# EAGLE schematic KsbLightSensorSchematic (EAGLE 7.2.0)
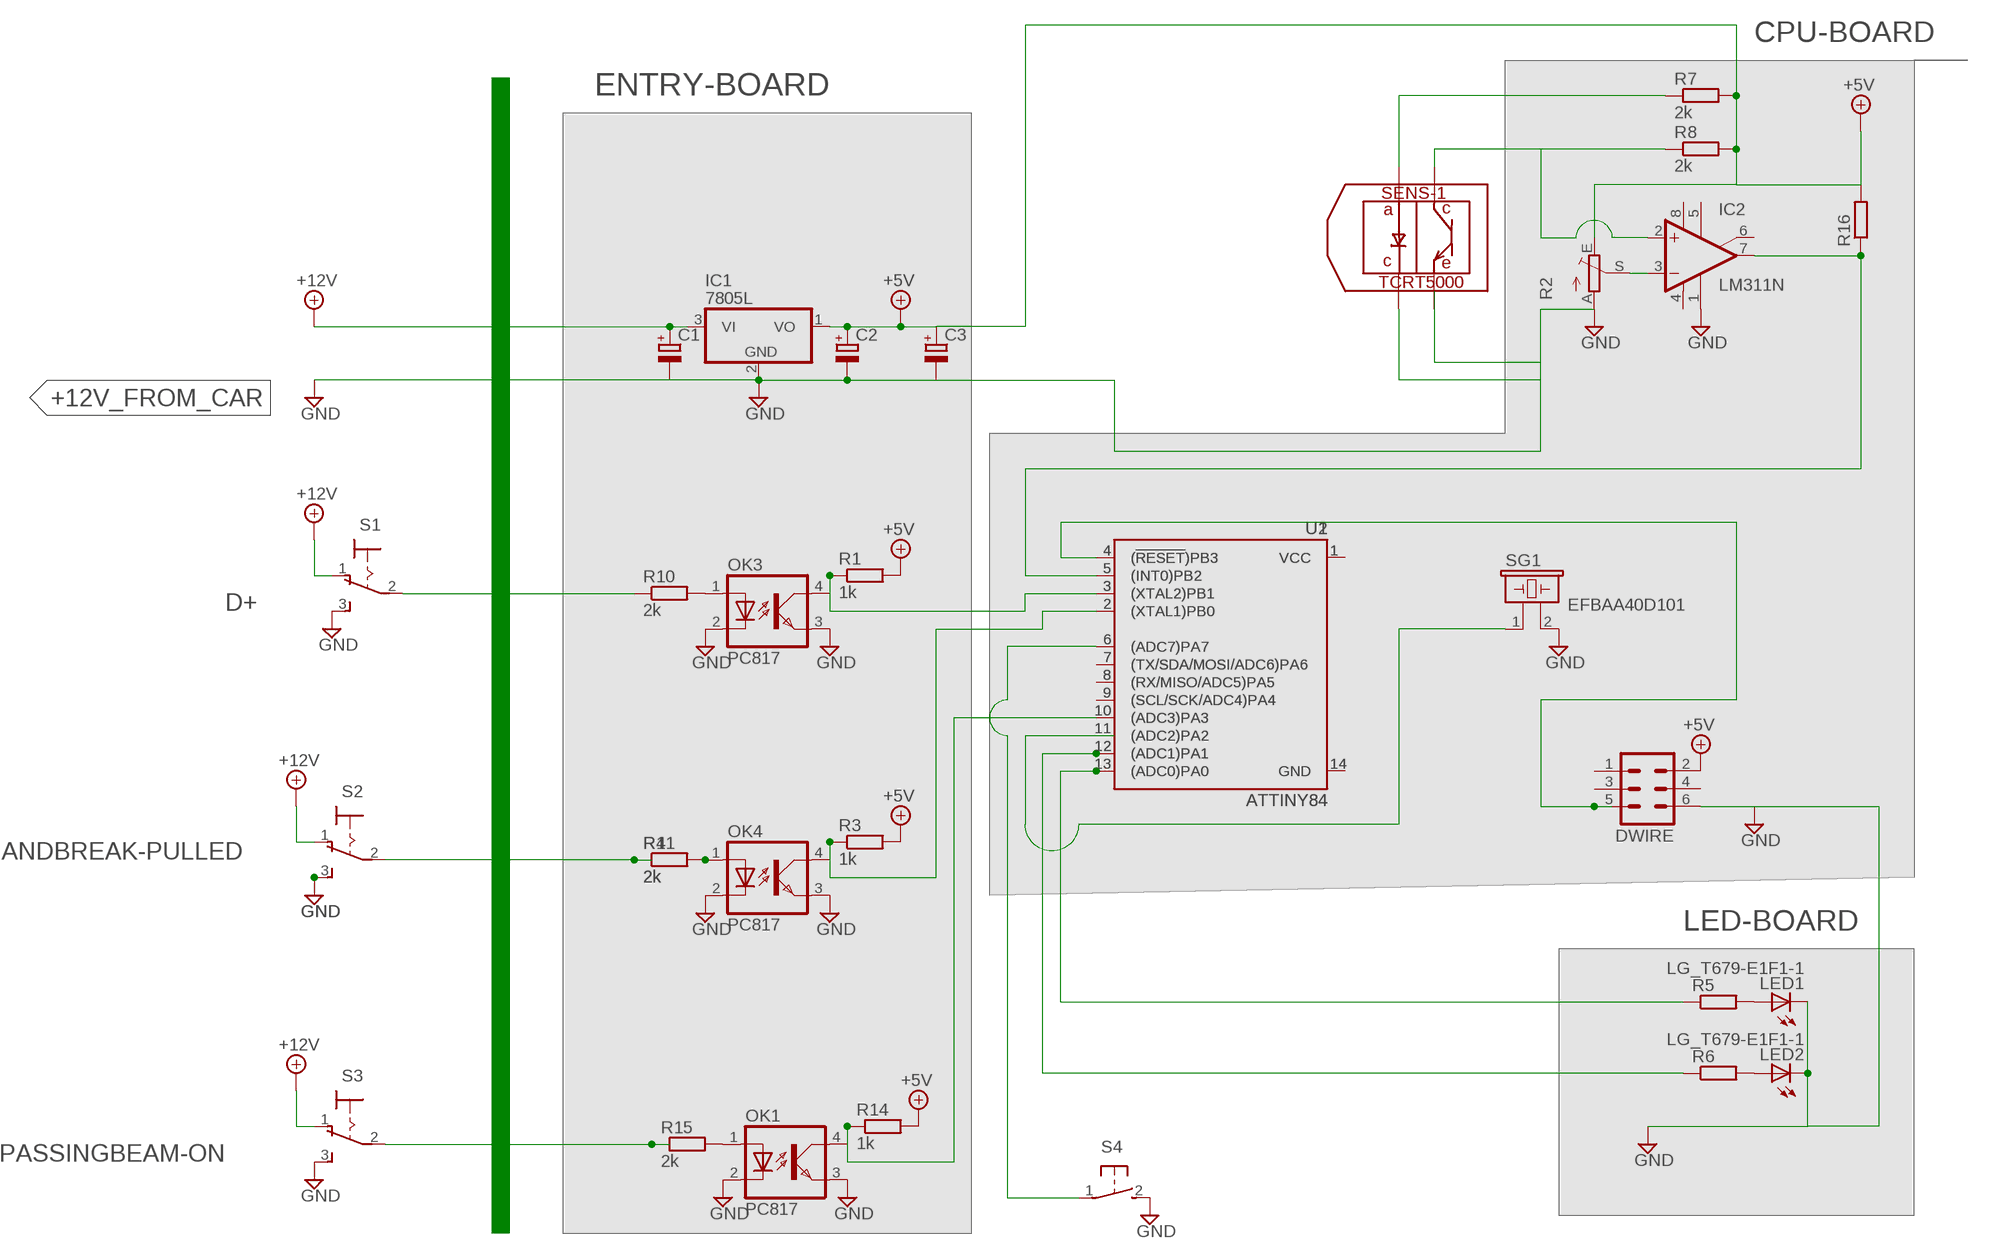
[diagram p0: schematic, sheet 1]

## Parts
C1  CPOL-EU140CLH-0810  [140CLH-0810]
C2  CPOL-EU140CLH-0810  [140CLH-0810]
C3  CPOL-EU140CLH-0810  [140CLH-0810]
DWIRE  MA03-2  [MA03-2]
IC1  7805L  [TO92]
IC2  LM311N  [DIL08]
LED1  LG_T679-E1F1-1  [PLCC2]
LED2  LG_T679-E1F1-1  [PLCC2]
OK1  PC817  [DIL04]
OK3  PC817  [DIL04]
OK4  PC817  [DIL04]
R1  1k  R-EU_0613/5V  [P0613V]
R2  TRIM_EU-B90P  [SP19L]
R3  1k  R-EU_0613/5V  [P0613V]
R4  2k  R-EU_0613/5V  [P0613V]
R5  R-EU_0613/5V  [P0613V]
R6  R-EU_0613/5V  [P0613V]
R7  2k  R-EU_0613/5V  [P0613V]
R8  2k  R-EU_0613/5V  [P0613V]
R10  2k  R-EU_0613/5V  [P0613V]
R11  2k  R-EU_0613/5V  [P0613V]
R14  1k  R-EU_0613/5V  [P0613V]
R15  2k  R-EU_0613/5V  [P0613V]
R16  R-EU_0613/5V  [P0613V]
S1  320-916  [320-916]
S2  320-916  [320-916]
S3  320-916  [320-916]
S4  31-XX  [B3F-31XX]
SENS-1  TCRT5000  [5000]
SG1  EFBAA40D101  [EFBAA40D101]
U1  ATTINY84  [SO14]
U2  ATTINY84  [SO14]

## Nets
+12V: DWIRE.2 R1.2 R3.2 R14.2 S1.1(O) S3.1(O) ; supply symbol labelled +5V
+12V_FROM_CAR: C1.+ IC1.3(VI) ; supply symbol labelled +12V
CPU-BOARD: IC2.7(OUT) R16.1 U1.5((INT0)PB2) U2.5((INT0)PB2)
D+: R10.1 S1.2(P)
ENTRY-BOARD: C2.+ C3.+ IC1.1(VO) R2.E R7.2 R8.2 R16.2 ; supply symbol labelled +5V
GND: C1.- C2.- C3.- DWIRE.6 IC1.2(GND) IC2.1(GND) LED1.C LED2.C OK1.2(C) OK1.3(EMIT) OK3.2(C) OK3.3(EMIT) OK4.2(C) OK4.3(EMIT) R2.A S1.3(S) S2.3(S) S3.3(S) S4.2(S) SENS-1.P$2 SENS-1.P$4 SG1.2
HANDBREAK-PULLED: S2.1(O) ; supply symbol labelled +12V
LED-BOARD: R5.1 U1.13((ADC0)PA0) U2.13((ADC0)PA0)
N$1: OK4.1(A) R4.2 R11.2
N$2: R7.1 SENS-1.P$3
N$3: OK3.1(A) R10.2
N$4: IC2.2(+IN) R8.1 SENS-1.P$1
N$5: OK1.4(COL) R14.1 U1.10((ADC3)PA3) U2.10((ADC3)PA3)
N$6: OK4.4(COL) R3.1 U1.2((XTAL1)PB0) U2.2((XTAL1)PB0)
N$7: DWIRE.5 U1.4((!RESET!)PB3) U2.4((!RESET!)PB3)
N$8: LED1.A R5.2
N$9: LED2.A R6.2
N$11: U1.1(VCC) U2.1(VCC)
N$12: R6.1 U1.12((ADC1)PA1) U2.12((ADC1)PA1)
N$13: IC2.3(-IN) R2.S
N$14: SG1.1 U2.11((ADC2)PA2)
N$15: OK3.4(COL) R1.1 U1.3((XTAL2)PB1) U2.3((XTAL2)PB1)
N$16: OK1.1(A) R15.2
N$17: U1.9((SCL/SCK/ADC4)PA4) U2.9((SCL/SCK/ADC4)PA4)
N$18: U1.8((RX/MISO/ADC5)PA5) U2.8((RX/MISO/ADC5)PA5)
N$20: U1.7((TX/SDA/MOSI/ADC6)PA6) U2.7((TX/SDA/MOSI/ADC6)PA6)
N$21: S4.1(P) U1.6((ADC7)PA7) U2.6((ADC7)PA7)
N$22: U1.14(GND) U2.14(GND)
PASSING-BEAM-ON1: R15.1
PASSINGBEAM-ON: R4.1 R11.1 S2.2(P) S3.2(P)
Unconnected: DWIRE.1 DWIRE.3 DWIRE.4 IC2.5(ON) IC2.6(ON/STR) U1.11((ADC2)PA2)

## Power pins joined to a net without a drawn wire
V+: IC2.8(V+)
V-: IC2.4(V-)

## Library data of the parts
C1-C3 = resistor:CPOL-EU: POLARIZED CAPACITOR, European symbol
DWIRE = con-lstb:MA03-2: PIN HEADER; OC_FARNELL: unknown; OC_NEWARK: unknown
IC1 = linear:78*: Positive VOLTAGE REGULATOR Source: http://cache.national.com/ds/LM/LM78L05.pdf http://www.fairchildsemi.com/ds/LM/LM7805.pdf
IC2 = linear:LM311: COMPARATOR
LED1 LED2 = led:*_T679-?-1: LC TOPLED® Low Current LED Source: http://catalog.osram-os.com .. LG_LS_LY_T679_OBS.pdf; COLOR: green
OK1 OK3 OK4 = optocoupler:PC817: SHARP OPTO COUPLER
R1 R3-R8 R10 R11 R14-R16 = resistor:R-EU_: RESISTOR, European symbol
R2 = pot:TRIM_EU-: POTENTIOMETER
S1-S3 = switch:320-916: TOGGLE SWITCH distributor RS Components
S4 = switch-omron:31-XX: OMRON SWITCH; MPN: B3F-3100; OC_FARNELL: 959704; OC_NEWARK: 36M3582
SENS-1 = qfm-trx1-24g:TCRT5000: Reflective Optical Sensor with Transistor Output. Vishay Semiconductors
SG1 = buzzer:EFB?: Piezoelectric Acoustic Transducer Source: Panbasonic .. 2SC1685.pdf
U1 U2 = SparkFun-IC-Microcontroller:ATTINY84: Atmel 14-pin 2/4/8kB flash uC Datasheet <https://cdn.sparkfun.com/datasheets/Widgets/doc8006.pdf> SparkFun Products Tiny AVR Programmer <https://www.sparkfun.com/products/11801> (PGM-11801) SparkFun Servo Trigger - Continuous Rotation <https://www.sparkfun.com/products/13872> (WIG-13872) SparkFun Servo Trigger <https://www.sparkfun.com/products/13118> (WIG-13118); PROD_ID: IC-11285